# Altium project UltraZOhm_CarrierBoard.PrjPcb (part 7 of 8)

## Sheet GTR_crossover.schdoc
size A4; Author: A. Geiger & E. Liegmann; CompanyName: Technische Hochschule Nürnberg Georg Simon Ohm; Organization: UltraZohm; Address1: Kesslerplatz 12; Address2: 90489 Nürnberg; Address3: GERMANY; SheetNumber: 35; SheetTotal: 36; Website: www.ultrazohm.com
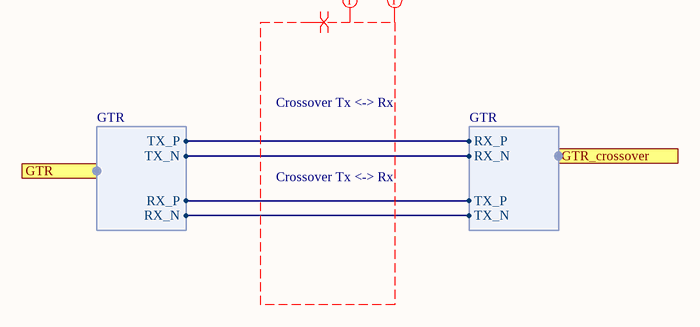
[diagram p21: GTR_crossover.schdoc]

### Ports
GTR (harness GTR), GTR_crossover (harness GTR)

### Harnesses
GTR: RX_N, RX_P, TX_N, TX_P

### Nets
(unnamed): port GTR.RX_N, port GTR_crossover.TX_N
(unnamed): port GTR.RX_P, port GTR_crossover.TX_P
(unnamed): port GTR.TX_N, port GTR_crossover.RX_N
(unnamed): port GTR.TX_P, port GTR_crossover.RX_P

### Layout directives
differential pair: (no net found under the mark)
net class HS: (no net found under the mark)
net class SATA: (no net found under the mark)

### Notes on the sheet
- Crossover Tx <-> Rx
- Title
- Revision:
- Design Engineer:
- Date:
- Project:
- Sheet
- of

## Sheet XMOD.SchDoc
size A4; Author: A. Geiger & E. Liegmann; CompanyName: Technische Hochschule Nürnberg Georg Simon Ohm; Organization: UltraZohm; Address1: Kesslerplatz 12; Address2: 90489 Nürnberg; Address3: GERMANY; SheetNumber: 15; SheetTotal: 36; Website: www.ultrazohm.com
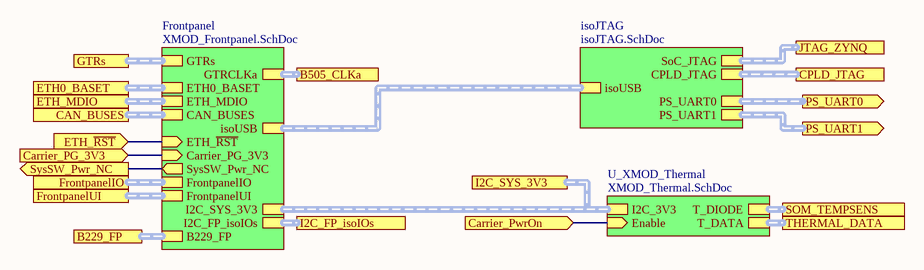
[diagram p22: XMOD.SchDoc]

### Sub-sheets
Frontpanel = XMOD_Frontpanel.SchDoc (file not in this document): GTRs (harness GTRs), ETH0_BASET (harness ETH_BASET), ETH_MDIO (harness ETH_MDIO), isoUSB (harness USB), I2C_SYS_3V3 (harness I2C), FrontpanelUI (harness FrontpanelUI), SysSW_Pwr_NC (out), GTRCLKa (harness MGTCLK), CAN_BUSES (harness CAN_BUSES), FrontpanelIO (harness FrontpanelIO), ETH_~{RST} (in), Carrier_PG_3V3 (in), I2C_FP_isoIOs (harness I2C), B229_FP (harness GTH)
isoJTAG = isoJTAG.SchDoc (file not in this document): SoC_JTAG (harness JTAG), CPLD_JTAG (harness JTAG), PS_UART0 (harness UART), PS_UART1 (harness UART), isoUSB (harness USB)
U_XMOD_Thermal = XMOD_Thermal.SchDoc (file not in this document): I2C_3V3 (harness I2C), T_DIODE (harness T_DIODE), T_DATA (harness T_DATA), Enable (in)

### Ports
B229_FP (harness GTH), B505_CLKa (harness MGTCLK), CAN_BUSES (harness CAN_BUSES), Carrier_PG_3V3 (in), Carrier_PwrOn (in), CPLD_JTAG (harness JTAG), ETH0_BASET (harness ETH_BASET), ETH_MDIO (harness ETH_MDIO), ETH_~{RST} (in), FrontpanelIO (harness FrontpanelIO), FrontpanelUI (harness FrontpanelUI), GTRs (harness GTRs), I2C_FP_isoIOs (harness I2C), I2C_SYS_3V3 (harness I2C), JTAG_ZYNQ (harness JTAG), PS_UART0 (out, harness UART), PS_UART1 (out, harness UART), SOM_TEMPSENS (harness T_DIODE), SysSW_Pwr_NC (out), THERMAL_DATA (harness T_DATA)

### Nets
Carrier_PG_3V3: port Carrier_PG_3V3, sheet Frontpanel/Carrier_PG_3V3
Carrier_PwrOn: port Carrier_PwrOn, sheet U_XMOD_Thermal/Enable
ETH_~{RST}: port ETH_~{RST}, sheet Frontpanel/ETH_~{RST}
SysSW_Pwr_NC: port SysSW_Pwr_NC, sheet Frontpanel/SysSW_Pwr_NC

### Buses and harness runs
harness port B229_FP = sheet Frontpanel/B229_FP
harness port B505_CLKa = sheet Frontpanel/GTRCLKa
harness port CAN_BUSES = sheet Frontpanel/CAN_BUSES
harness port CPLD_JTAG = sheet isoJTAG/CPLD_JTAG
harness port ETH0_BASET = sheet Frontpanel/ETH0_BASET
harness port ETH_MDIO = sheet Frontpanel/ETH_MDIO
harness port FrontpanelIO = sheet Frontpanel/FrontpanelIO
harness port FrontpanelUI = sheet Frontpanel/FrontpanelUI
harness port GTRs = sheet Frontpanel/GTRs
harness port I2C_FP_isoIOs = sheet Frontpanel/I2C_FP_isoIOs
harness port I2C_SYS_3V3 = sheet Frontpanel/I2C_SYS_3V3 = sheet U_XMOD_Thermal/I2C_3V3
harness port JTAG_ZYNQ = sheet isoJTAG/SoC_JTAG
harness port PS_UART0 = sheet isoJTAG/PS_UART0
harness port PS_UART1 = sheet isoJTAG/PS_UART1
harness port SOM_TEMPSENS = sheet U_XMOD_Thermal/T_DIODE
harness port THERMAL_DATA = sheet U_XMOD_Thermal/T_DATA
harness sheet Frontpanel/isoUSB = sheet isoJTAG/isoUSB

### Notes on the sheet
- Title
- Revision:
- Design Engineer:
- Date:
- Project:
- Sheet
- of

## Sheet Collective_FAULT_logic.SchDoc
size A4; Author: A. Geiger & E. Liegmann; CompanyName: Technische Hochschule Nürnberg Georg Simon Ohm; Organization: UltraZohm; Address1: Kesslerplatz 12; Address2: 90489 Nürnberg; Address3: GERMANY; SheetNumber: 10; SheetTotal: 36; Website: www.ultrazohm.com
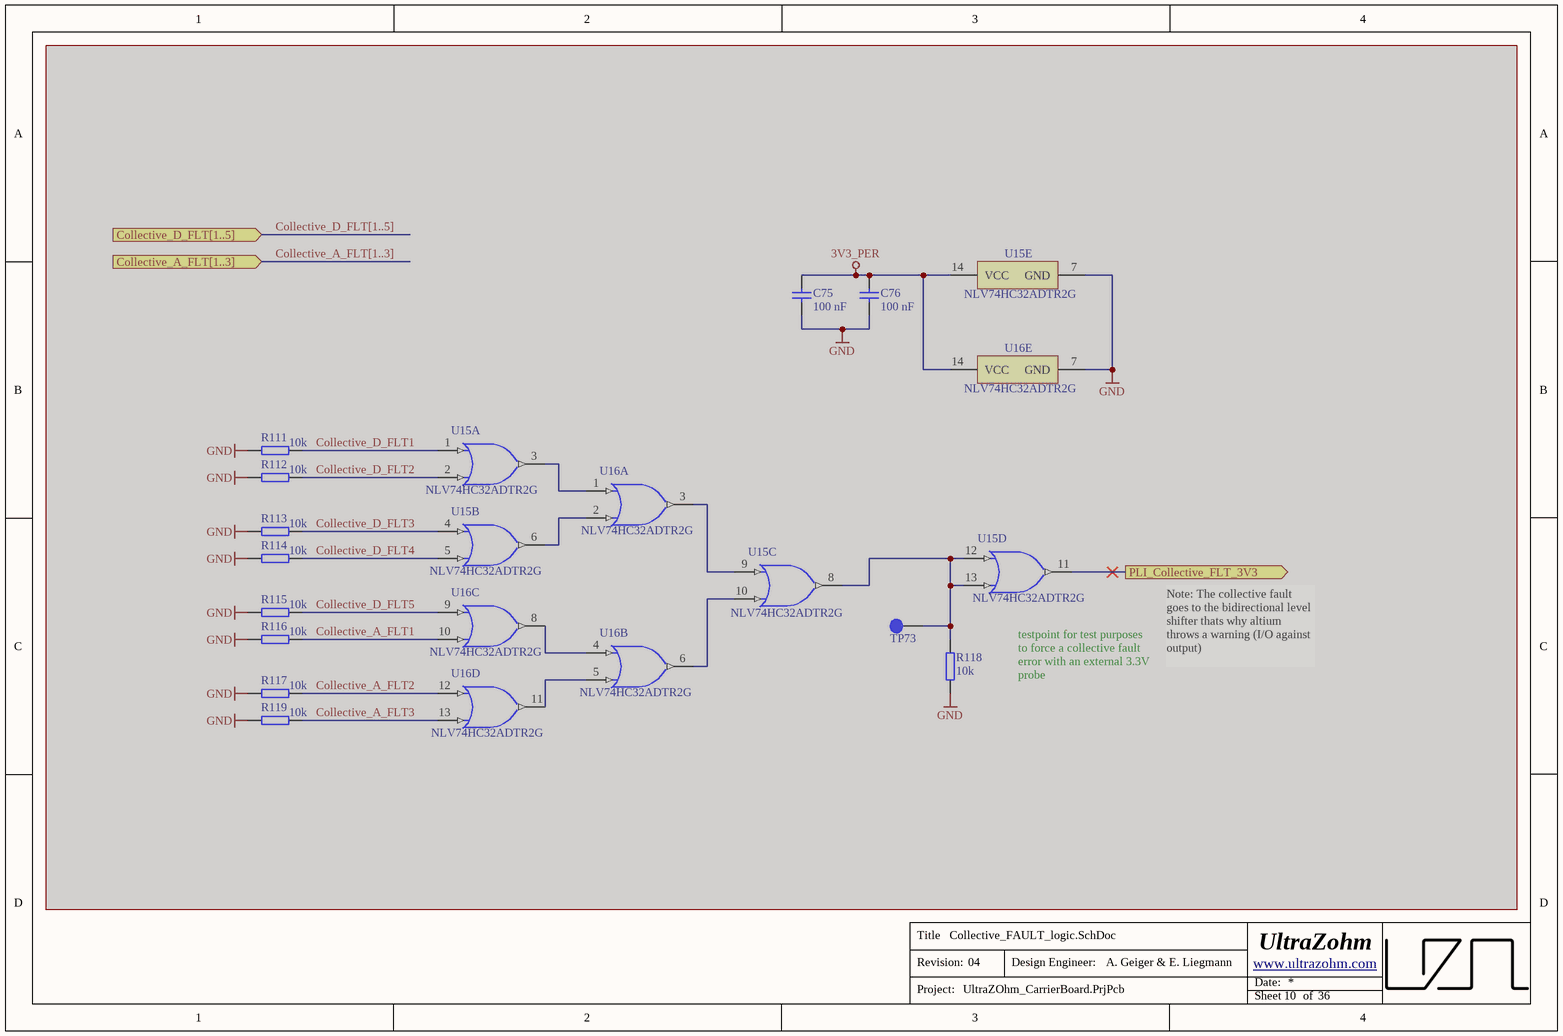
[diagram p23: Collective_FAULT_logic.SchDoc]

### Parts
C75  100 nF  [C_0603_TE]  (masked out: inside a compile mask, not in the netlist)
C76  100 nF  [C_0603_TE]  (masked out: inside a compile mask, not in the netlist)
R111  10k  [R_0603_TE]  (masked out: inside a compile mask, not in the netlist)
R112  10k  [R_0603_TE]  (masked out: inside a compile mask, not in the netlist)
R113  10k  [R_0603_TE]  (masked out: inside a compile mask, not in the netlist)
R114  10k  [R_0603_TE]  (masked out: inside a compile mask, not in the netlist)
R115  10k  [R_0603_TE]  (masked out: inside a compile mask, not in the netlist)
R116  10k  [R_0603_TE]  (masked out: inside a compile mask, not in the netlist)
R117  10k  [R_0603_TE]  (masked out: inside a compile mask, not in the netlist)
R118  10k  [R_0603_TE]  (masked out: inside a compile mask, not in the netlist)
R119  10k  [R_0603_TE]  (masked out: inside a compile mask, not in the netlist)
TP73  Testpoint 1mm  [TP_1mm]  (value not drawn)  (no BOM)  (masked out: inside a compile mask, not in the netlist)
U15  NLV74HC32ADTR2G  [SOP65P640X120-14N]  (parts A,B,C,D,E of 5)  (masked out: inside a compile mask, not in the netlist)
U16  NLV74HC32ADTR2G  [SOP65P640X120-14N]  (parts A,B,C,D,E of 5)  (masked out: inside a compile mask, not in the netlist)

### Ports
Collective_A_FLT[1..3] (in), Collective_D_FLT[1..5] (in), PLI_Collective_FLT_3V3 (out)

### Notes on the sheet
- (near U15) testpoint for test purposes to force a collective fault error with an external 3.3V probe
- Note: The collective fault goes to the bidirectional level shifter thats why altium throws a warning (I/O against output)
- Title
- Revision:
- Design Engineer:
- Date:
- Project:
- Sheet
- of

### Library data of the parts
C75 C76 = UZgen_C_0603_100nF_50V_X7R: Generic capacitor; Manufacturer: UZgen; Tolerance: 10 %; Voltage: 50 V; Created from: AGeiger; Value: 100 nF; Technology: X7R; Manufacturer Part Number: UZgen_C_0603_100nF_50V_X7R; PartID: 1; Created On: 02/07/2024 14:42:23; Device Package: 0603; Mounting Type: SMD; Last Updated: 02/08/2024 14:45:57
R111-R119 = UZgen_R_0603_10k: Generic resistor; Manufacturer: UZgen; Tolerance: 1 %; Created from: AGeiger; Value: 10k; Manufacturer Part Number: UZgen_R_0603_10k; PartID: 1; Created On: 02.07.2024 14:34:53; Device Package: 0603; Mounting Type: SMD; Last Updated: 02.07.2024 14:37:16
TP73 = 25063: AN: 25063; Mixed: SMT
U15 U16 = 30783: AN: 30783; Mixed: SMT; Trenz-Stock: Yes; Temperature-Range: -55/+125; Extra: Quad 2-Input Positive-Or Gate; Case: TSSOP14; HelpURL: b:\AD\adlib\datasheet\ON_Semiconductor\MC74HC32A\; H-ART: NLV74HC32ADTR2G; Storage-Temperature: -65/+150 (Abs)

## Sheet LevelShifting.SchDoc
size A4; Author: A. Geiger & E. Liegmann; CompanyName: Technische Hochschule Nürnberg Georg Simon Ohm; Organization: UltraZohm; Address1: Kesslerplatz 12; Address2: 90489 Nürnberg; Address3: GERMANY; SheetNumber: 11; SheetTotal: 36; Website: www.ultrazohm.com
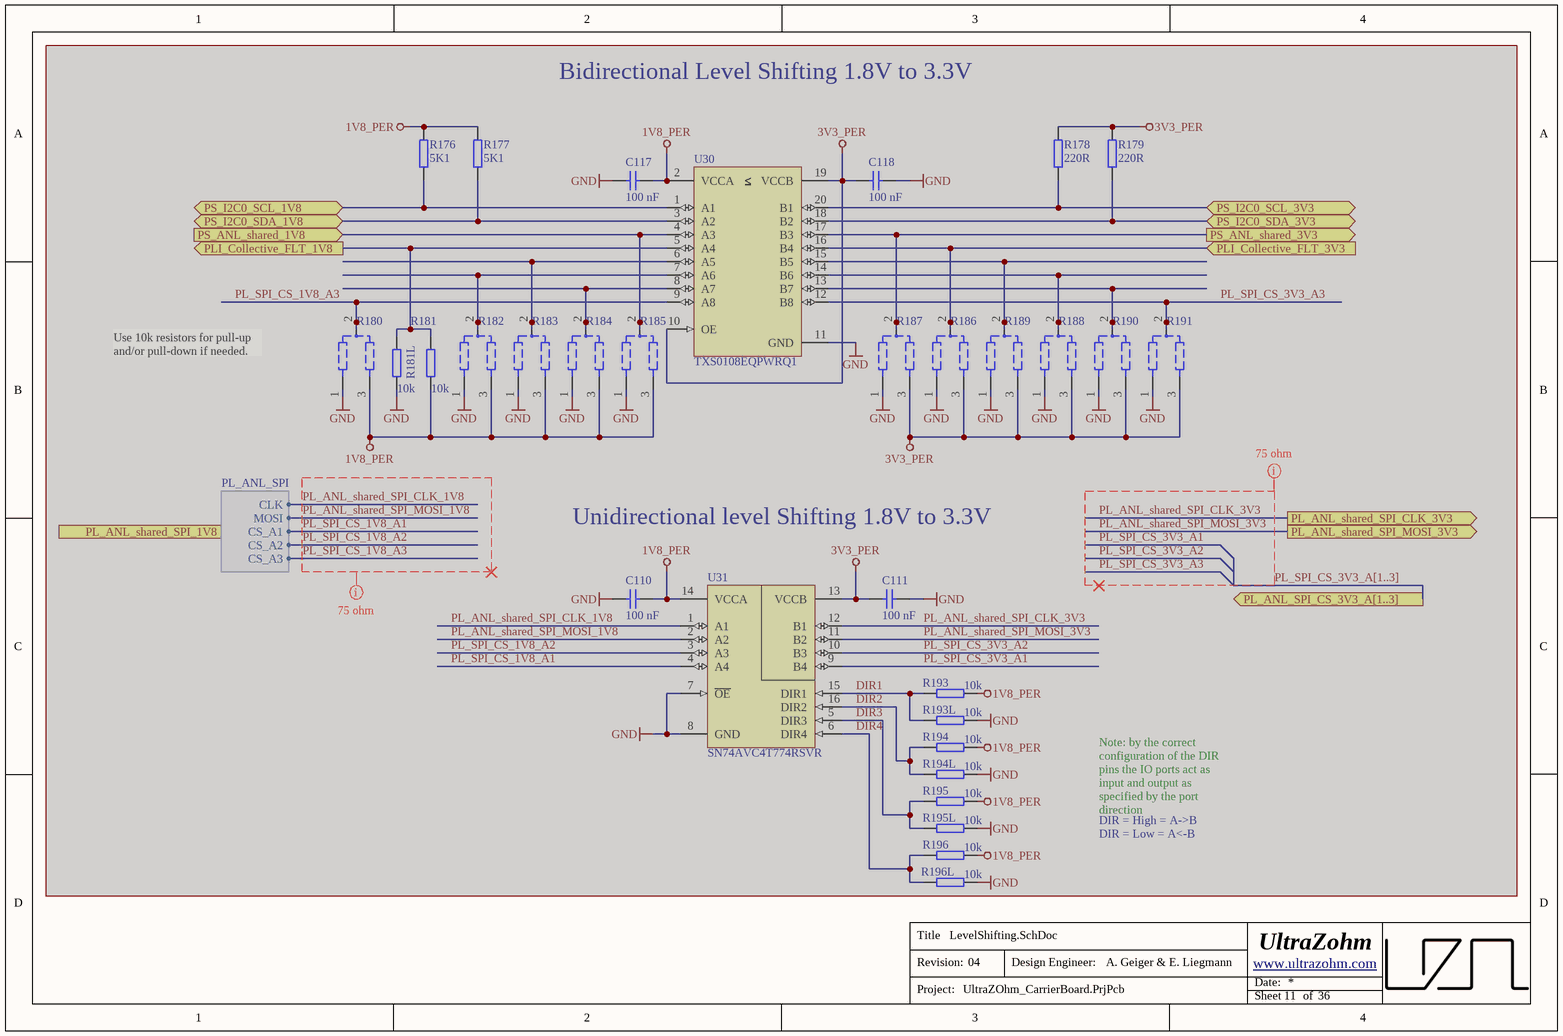
[diagram p24: LevelShifting.SchDoc]

### Parts
C110  100 nF  [C_0603_TE]  (masked out: inside a compile mask, not in the netlist)
C111  100 nF  [C_0603_TE]  (masked out: inside a compile mask, not in the netlist)
C117  100 nF  [C_0603_TE]  (masked out: inside a compile mask, not in the netlist)
C118  100 nF  [C_0603_TE]  (masked out: inside a compile mask, not in the netlist)
R176  5K1  [RESC1608X55N_V]  (masked out: inside a compile mask, not in the netlist)
R177  5K1  [RESC1608X55N_V]  (masked out: inside a compile mask, not in the netlist)
R178  220R  [RESC1608X55N_V]  (masked out: inside a compile mask, not in the netlist)
R179  220R  [RESC1608X55N_V]  (masked out: inside a compile mask, not in the netlist)
R180  Manual Assembly 1608 (0603)  [TP_DUAL_RES_0603]  (value not drawn)  (no BOM)  (masked out: inside a compile mask, not in the netlist)
R181  10k  [R_0603_TE]  (masked out: inside a compile mask, not in the netlist)
R181L  10k  [R_0603_TE]  (masked out: inside a compile mask, not in the netlist)
R182  Manual Assembly 1608 (0603)  [TP_DUAL_RES_0603]  (value not drawn)  (no BOM)  (masked out: inside a compile mask, not in the netlist)
R183  Manual Assembly 1608 (0603)  [TP_DUAL_RES_0603]  (value not drawn)  (no BOM)  (masked out: inside a compile mask, not in the netlist)
R184  Manual Assembly 1608 (0603)  [TP_DUAL_RES_0603]  (value not drawn)  (no BOM)  (masked out: inside a compile mask, not in the netlist)
R185  Manual Assembly 1608 (0603)  [TP_DUAL_RES_0603]  (value not drawn)  (no BOM)  (masked out: inside a compile mask, not in the netlist)
R186  Manual Assembly 1608 (0603)  [TP_DUAL_RES_0603]  (value not drawn)  (no BOM)  (masked out: inside a compile mask, not in the netlist)
R187  Manual Assembly 1608 (0603)  [TP_DUAL_RES_0603]  (value not drawn)  (no BOM)  (masked out: inside a compile mask, not in the netlist)
R188  Manual Assembly 1608 (0603)  [TP_DUAL_RES_0603]  (value not drawn)  (no BOM)  (masked out: inside a compile mask, not in the netlist)
R189  Manual Assembly 1608 (0603)  [TP_DUAL_RES_0603]  (value not drawn)  (no BOM)  (masked out: inside a compile mask, not in the netlist)
R190  Manual Assembly 1608 (0603)  [TP_DUAL_RES_0603]  (value not drawn)  (no BOM)  (masked out: inside a compile mask, not in the netlist)
R191  Manual Assembly 1608 (0603)  [TP_DUAL_RES_0603]  (value not drawn)  (no BOM)  (masked out: inside a compile mask, not in the netlist)
R193  10k  [R_0603_TE]  (masked out: inside a compile mask, not in the netlist)
R193L  10k  [R_0603_TE]  (masked out: inside a compile mask, not in the netlist)
R194  10k  [R_0603_TE]  (masked out: inside a compile mask, not in the netlist)
R194L  10k  [R_0603_TE]  (masked out: inside a compile mask, not in the netlist)
R195  10k  [R_0603_TE]  (masked out: inside a compile mask, not in the netlist)
R195L  10k  [R_0603_TE]  (masked out: inside a compile mask, not in the netlist)
R196  10k  [R_0603_TE]  (masked out: inside a compile mask, not in the netlist)
R196L  10k  [R_0603_TE]  (masked out: inside a compile mask, not in the netlist)
U30  TXS0108EQPWRQ1  [SOP65P640X120-20N]  (masked out: inside a compile mask, not in the netlist)
U31  SN74AVC4T774RSVR  [QFN40P260X180X55-16N]  (masked out: inside a compile mask, not in the netlist)

### Ports
PL_ANL_shared_SPI_1V8 (harness PL_ANL_SPI), PL_ANL_shared_SPI_CLK_3V3 (out), PL_ANL_shared_SPI_MOSI_3V3 (out), PL_ANL_SPI_CS_3V3_A[1..3] (out), PLI_Collective_FLT_1V8 (out), PLI_Collective_FLT_3V3 (in), PS_ANL_shared_1V8 (in), PS_ANL_shared_3V3 (out), PS_I2C0_SCL_1V8 (bidir), PS_I2C0_SCL_3V3 (bidir), PS_I2C0_SDA_1V8 (bidir), PS_I2C0_SDA_3V3 (bidir)

### Harnesses
PL_ANL_SPI: CLK, CS_A1, CS_A2, CS_A3, MOSI

### Layout directives
net class S75: PL_ANL_shared_SPI_CLK_1V8, PL_ANL_shared_SPI_CLK_3V3, PL_ANL_shared_SPI_MOSI_1V8, PL_ANL_shared_SPI_MOSI_3V3, PL_SPI_CS_1V8_A1, PL_SPI_CS_1V8_A2, PL_SPI_CS_1V8_A3, PL_SPI_CS_3V3_A1, PL_SPI_CS_3V3_A2, PL_SPI_CS_3V3_A3, PL_SPI_CS_3V3_A[1..3]

### Notes on the sheet
- Bidirectional Level Shifting 1.8V to 3.3V
- Use 10k resistors for pull-up and/or pull-down if needed.
- Unidirectional level Shifting 1.8V to 3.3V
- DIR = High = A->B
- DIR = Low = A<-B
- Note: by the correct configuration of the DIR pins the IO ports act as input and output as specified by the port direction
- Title
- Revision:
- Design Engineer:
- Date:
- Project:
- Sheet
- of

### Library data of the parts
C110 C111 C117 C118 = UZgen_C_0603_100nF_50V_X7R: as C75 on sheet Collective_FAULT_logic; Value: 100 nF; Technology: X7R; Manufacturer Part Number: UZgen_C_0603_100nF_50V_X7R; PartID: 1; Created On: 02/07/2024 14:42:23; Device Package: 0603; Mounting Type: SMD; Last Updated: 02/08/2024 14:45:57
R176 R177 = 21379: WID SMD 5K1 1% 0,1W; AN: 21379; Mixed: SMT; Value: 5.1K; Preferred: Yes; Extra: BF 1608 (0603); Tolerance: 1%; Case: 1608 (0603); Technology: TK100
R178 R179 = 22324: WID SMD 220R 1% 0,1W; Value: 220; AN: 22324; Mixed: SMT; Extra: BF 1608 (0603); Tolerance: 1%; Case: 1608 (0603); Technology: TK100
R180 R182-R191 = 30792: Manual Assembly Resistors Placeholder 1608 (0603) Dual; AN: 30792; Mixed: MECH
R181 R181L R193 R193L R194 R194L R195 R195L R196 R196L = UZgen_R_0603_10k: as R111-R119 on sheet Collective_FAULT_logic; Value: 10k; Manufacturer Part Number: UZgen_R_0603_10k; PartID: 1; Created On: 02.07.2024 14:34:53; Device Package: 0603; Mounting Type: SMD; Last Updated: 02.07.2024 14:37:16
U30 = 30791: AN: 30791; Mixed: SMT; Temperature-Range: -40/+85; Extra: 8-Bit Bidirectional Voltage Translator for OD/Push-Pull; HelpURL: b:\AD\adlib\datasheet\TI\TXS0108E-Q1\; H-ART: TXS0108EQPWRQ1; Storage-Temperature: -65/+150(Abs); Case: TSSOP20
U31 = 27170: AN: 27170; Mixed: SMT; Trenz-Stock: Yes; Extra: 4-Bit Dual-Supply Bus Transceiver With Configurable Voltage Translationand 3-Sta; HelpURL: B:\ad\adlib\datasheet\sn74avc4t774; Case: UQFN-16; H-ART: SN74AVC4T774RSVR

## Sheet LevelShiftingXMOD.SchDoc
size A4; Author: A. Geiger & E. Liegmann; CompanyName: Technische Hochschule Nürnberg Georg Simon Ohm; Organization: UltraZohm; Address1: Kesslerplatz 12; Address2: 90489 Nürnberg; Address3: GERMANY; SheetNumber: 23; SheetTotal: 36; Website: www.ultrazohm.com
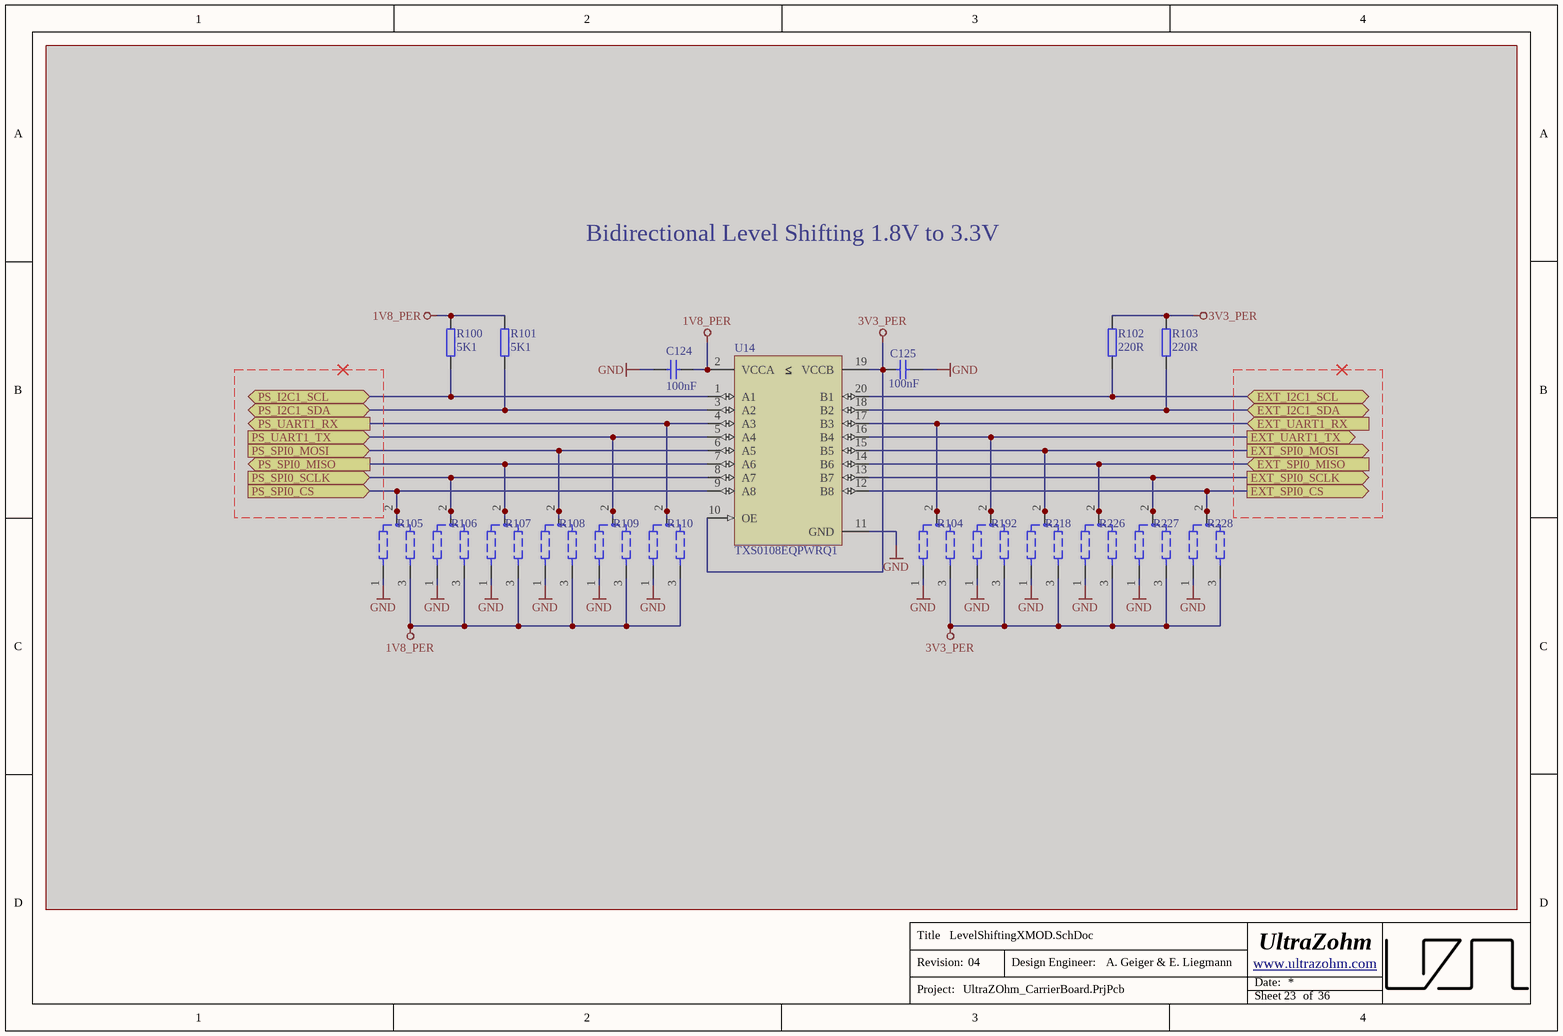
[diagram p25: LevelShiftingXMOD.SchDoc]

### Parts
(Parts that share a designator on the sheet are numbered #1, #2 ... from top to bottom, then left to right.)
C124  100nF  [CAPC1608X90N_V]  (masked out: inside a compile mask, not in the netlist)
C125  100nF  [CAPC1608X90N_V]  (masked out: inside a compile mask, not in the netlist)
R100  5K1  [RESC1608X55N_V]  (masked out: inside a compile mask, not in the netlist)
R101  5K1  [RESC1608X55N_V]  (masked out: inside a compile mask, not in the netlist)
R102  220R  [RESC1608X55N_V]  (masked out: inside a compile mask, not in the netlist)
R103  220R  [RESC1608X55N_V]  (masked out: inside a compile mask, not in the netlist)
R104  Manual Assembly 1608 (0603)  [TP_DUAL_RES_0603]  (value not drawn)  (no BOM)  (masked out: inside a compile mask, not in the netlist)
R105  Manual Assembly 1608 (0603)  [TP_DUAL_RES_0603]  (value not drawn)  (no BOM)  (masked out: inside a compile mask, not in the netlist)
R106  Manual Assembly 1608 (0603)  [TP_DUAL_RES_0603]  (value not drawn)  (no BOM)  (masked out: inside a compile mask, not in the netlist)
R107  Manual Assembly 1608 (0603)  [TP_DUAL_RES_0603]  (value not drawn)  (no BOM)  (masked out: inside a compile mask, not in the netlist)
R108#2  Manual Assembly 1608 (0603)  [TP_DUAL_RES_0603]  (value not drawn)  (no BOM)  (masked out: inside a compile mask, not in the netlist)
R109#2  Manual Assembly 1608 (0603)  [TP_DUAL_RES_0603]  (value not drawn)  (no BOM)  (masked out: inside a compile mask, not in the netlist)
R110#2  Manual Assembly 1608 (0603)  [TP_DUAL_RES_0603]  (value not drawn)  (no BOM)  (masked out: inside a compile mask, not in the netlist)
R192  Manual Assembly 1608 (0603)  [TP_DUAL_RES_0603]  (value not drawn)  (no BOM)  (masked out: inside a compile mask, not in the netlist)
R218  Manual Assembly 1608 (0603)  [TP_DUAL_RES_0603]  (value not drawn)  (no BOM)  (masked out: inside a compile mask, not in the netlist)
R226  Manual Assembly 1608 (0603)  [TP_DUAL_RES_0603]  (value not drawn)  (no BOM)  (masked out: inside a compile mask, not in the netlist)
R227  Manual Assembly 1608 (0603)  [TP_DUAL_RES_0603]  (value not drawn)  (no BOM)  (masked out: inside a compile mask, not in the netlist)
R228  Manual Assembly 1608 (0603)  [TP_DUAL_RES_0603]  (value not drawn)  (no BOM)  (masked out: inside a compile mask, not in the netlist)
U14  TXS0108EQPWRQ1  [SOP65P640X120-20N]  (masked out: inside a compile mask, not in the netlist)

### Ports
EXT_I2C1_SCL (bidir), EXT_I2C1_SDA (bidir), EXT_SPI0_CS (out), EXT_SPI0_MISO (in), EXT_SPI0_MOSI (out), EXT_SPI0_SCLK (out), EXT_UART1_RX (in), EXT_UART1_TX (out), PS_I2C1_SCL (bidir), PS_I2C1_SDA (bidir), PS_SPI0_CS (in), PS_SPI0_MISO (out), PS_SPI0_MOSI (in), PS_SPI0_SCLK (in), PS_UART1_RX (out), PS_UART1_TX (in)

### Notes on the sheet
- Bidirectional Level Shifting 1.8V to 3.3V
- Title
- Revision:
- Design Engineer:
- Date:
- Project:
- Sheet
- of

### Library data of the parts
C124 C125 = 21382: KON 100nF 50V X7R ±10% SMD BF 1608 (0603); Value: 100n; AN: 21382; Mixed: SMT; Preferred: Yes; Temperature-Range: -55/+125; Tolerance: ±10%; Voltage: 50V; Technology: X7R; Case: 1608 (0603)
R100 R101 = 21379: WID SMD 5K1 1% 0,1W; Value: 5.1K; AN: 21379; Mixed: SMT; Preferred: Yes; Extra: BF 1608 (0603); Tolerance: 1%; Case: 1608 (0603); Technology: TK100
R102 R103 = 22324: as R178 on sheet LevelShifting; Tolerance: 1%; Case: 1608 (0603); Technology: TK100
R104-R107 R108#2 R109#2 R110#2 R192 R218 R226-R228 = 30792: as R180 on sheet LevelShifting
U14 = 30791: as U30 on sheet LevelShifting; HelpURL: b:\AD\adlib\datasheet\TI\TXS0108E-Q1\; H-ART: TXS0108EQPWRQ1; Storage-Temperature: -65/+150(Abs); Case: TSSOP20

## Sheet isoGPIO.SchDoc
size A4; Author: A. Geiger & E. Liegmann; CompanyName: Technische Hochschule Nürnberg Georg Simon Ohm; Organization: UltraZohm; Address1: Kesslerplatz 12; Address2: 90489 Nürnberg; Address3: GERMANY; SheetNumber: 18; SheetTotal: 36; Website: www.ultrazohm.com
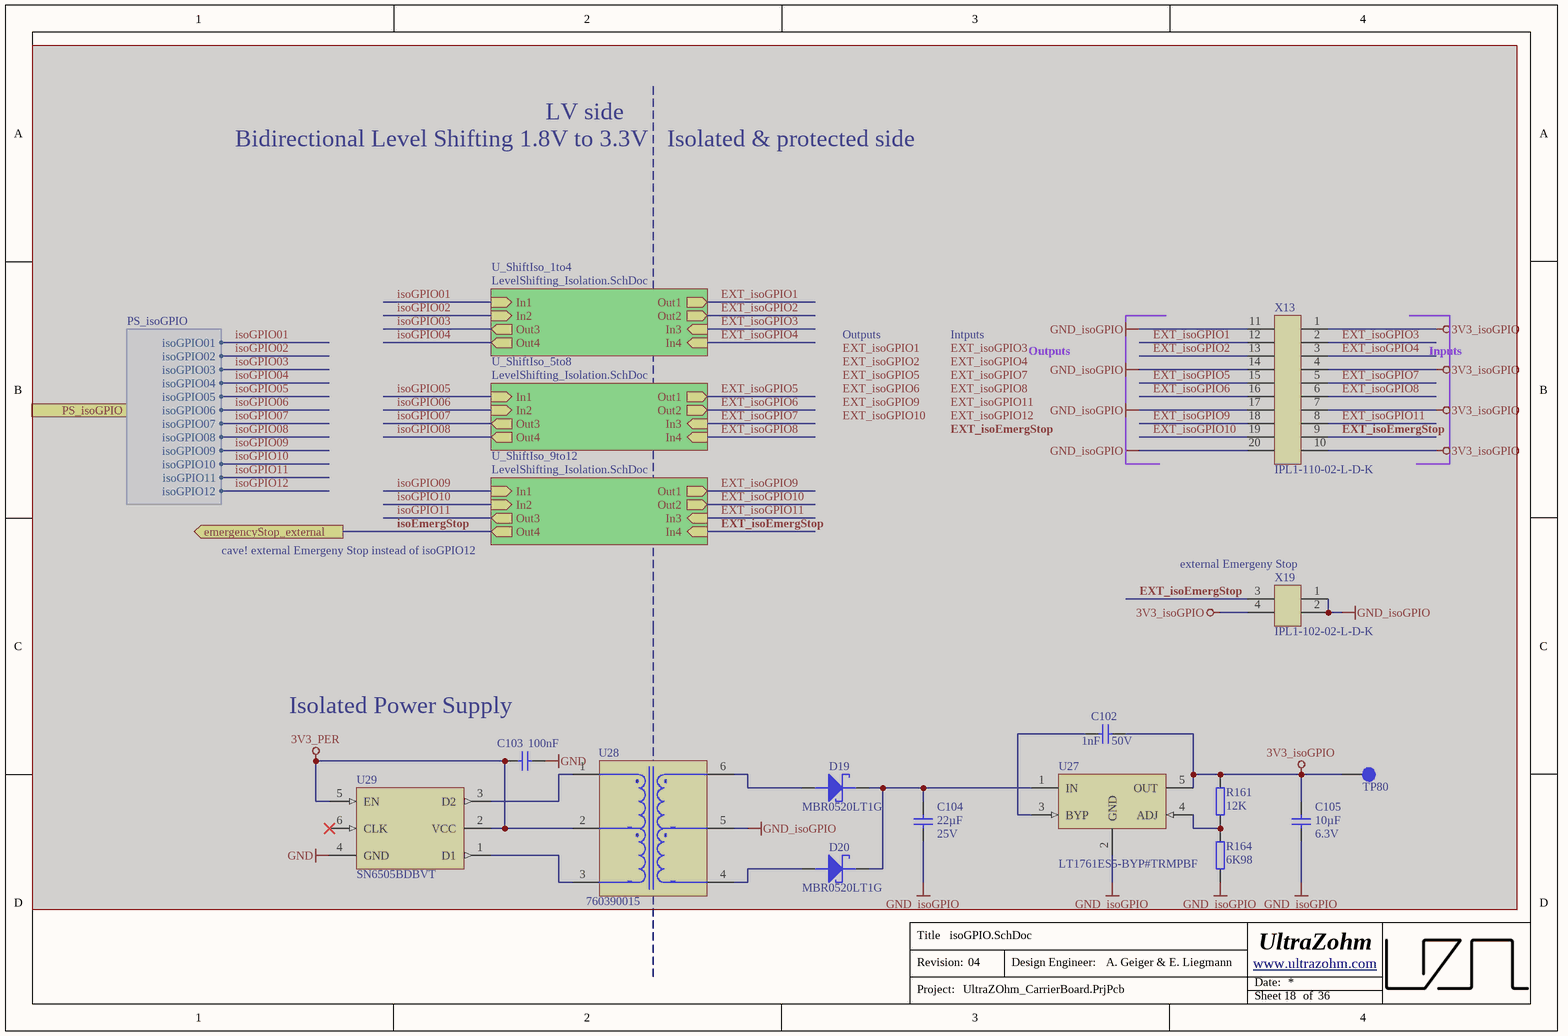
[diagram p26: isoGPIO.SchDoc]

### Parts
(Parts that share a designator on the sheet are numbered #1, #2 ... from top to bottom, then left to right.)
C102  1nF  Voltage: 50V  [CAPC1608X90N_V]  (masked out: inside a compile mask, not in the netlist)
C103  100nF  [CAPC1608X90N_V]  (masked out: inside a compile mask, not in the netlist)
C104  22µF  Voltage: 25V  [CAPC2012X135N_V]  (masked out: inside a compile mask, not in the netlist)
C105  10µF  Voltage: 6.3V  [CAPC1608X90N_V]  (masked out: inside a compile mask, not in the netlist)
D19#2  MBR0520LT1G  [SOD3816X120N]  (masked out: inside a compile mask, not in the netlist)
D20#2  MBR0520LT1G  [SOD3816X120N]  (masked out: inside a compile mask, not in the netlist)
R161  12K  [RESC1608X55N_V]  (masked out: inside a compile mask, not in the netlist)
R164  6K98  [RESC1608X55N_V]  (masked out: inside a compile mask, not in the netlist)
TP80  Testpoint 1mm  [TP_1mm]  (value not drawn)  (masked out: inside a compile mask, not in the netlist)
U27  LT1761ES5-BYP#TRMPBF  [SOT23-5_N]  (masked out: inside a compile mask, not in the netlist)
U28  760390015  [760390015]  (masked out: inside a compile mask, not in the netlist)
U29  SN6505BDBVT  [SOT95P280X145-6N]  (masked out: inside a compile mask, not in the netlist)
X13  IPL1-110-02-L-D-K  [IPL1-110-02-L-D-K]  (masked out: inside a compile mask, not in the netlist)
X19  IPL1-102-02-L-D-K  [IPL1-102-02-L-D-K]  (masked out: inside a compile mask, not in the netlist)

### Sub-sheets
U_ShiftIso_1to4 = LevelShifting_Isolation.SchDoc (masked out): In1 (in), In2 (in), In3 (in), In4 (in), Out1 (out), Out2 (out), Out4 (out), Out3 (out)
U_ShiftIso_5to8 = LevelShifting_Isolation.SchDoc (masked out): In1 (in), In2 (in), In3 (in), In4 (in), Out1 (out), Out2 (out), Out4 (out), Out3 (out)
U_ShiftIso_9to12 = LevelShifting_Isolation.SchDoc (masked out): In1 (in), In2 (in), In3 (in), In4 (in), Out1 (out), Out2 (out), Out4 (out), Out3 (out)

### Ports
emergencyStop_external (out), PS_isoGPIO (harness PS_isoGPIO)

### Harnesses
PS_isoGPIO: isoGPIO01, isoGPIO02, isoGPIO03, isoGPIO05, isoGPIO04, isoGPIO07, isoGPIO08, isoGPIO09, isoGPIO06, isoGPIO10, isoGPIO11, isoGPIO12

### Notes on the sheet
- Bidirectional Level Shifting 1.8V to 3.3V
- LV side
- Isolated & protected side
- Outputs
- Intputs
- Inputs
- cave! external Emergeny Stop instead of isoGPIO12
- (near X19) external Emergeny Stop
- (near C103) Isolated Power Supply
- Title
- Revision:
- Design Engineer:
- Date:
- Project:
- Sheet
- of

### Library data of the parts
C102 = 22523: KON 1nF 50V NP0 5% SMD BF 1608 (0603); Value: 1n; AN: 22523; Mixed: SMT; Technology: NP0; Case: 1608 (0603)
C103 = 21382: as C124 on sheet LevelShiftingXMOD; Tolerance: ±10%; Voltage: 50V; Technology: X7R; Case: 1608 (0603)
C104 = 29556: KON 22µF 25V  X5R 20% SMD BF 2012 (0805); Value: 22u; AN: 29556; Mixed: SMT; Temperature-Range: -55/+85; Technology: X5R; Case: 2012 (0805); Tolerance: 20%
C105 = 22918: KON 10µF 6,3V X5R SMD BF 1608 (0603); Value: 10u; AN: 22918; Mixed: SMT; Temperature-Range: -55/+85; Technology: X5R; Case: 1608 (0603)
D19#2 D20#2 = 26768: Schottky Diode 0.5A 20V SOD-123; AN: 26768; Mixed: SMT; Extra: AEC−Q101; Value: 20V; Case: SOD123-FC; Voltage: 0.5A; HelpURL: B:\AD\adlib\datasheet\MBR0520; H-ART: MBR0520LT1G
R161 = 22655: WID SMD 12K 1% 0,1W; AN: 22655; Mixed: SMT; Extra: BF 1608 (0603); Tolerance: 1%; Case: 1608 (0603); Technology: TK100; Value: 12K
R164 = 26473: WID SMD 6K98 1% 0,1W  BF 1608 (0603); AN: 26473; Mixed: SMT; Value: 6.98k; Preferred: Yes; Tolerance: 1%; Case: 1608 (0603); Technology: TK100
TP80 = 25063: AN: 25063; Mixed: SMT
U27 = LT1761ES5-BYP#TRMPBF: 100mA, Low Noise, LDO Micropower Regulators; belongs to SN74AVC4T774RSVR; Manufacturer: Linear Technology; Created from: MGremer; Manufacturer Part Number: LT1761ES5-BYP#TRMPBF; PartID: 5; Created On: 30.11.2020 13:55:34; ComponentLink1Description: Datasheet; ComponentLink1URL: https://www.analog.com/media/en/technical-documentation/data-sheets/1761sff.pdf; Component Type: LDO Micropower; Device Package: TSOT-23; Last Updated: 15.02.2021 10:27:30; Mounting Type: SMD; Supplier 1: Farnell; Supplier Part Number 1: 1663782; Type: LDO Micropower Regulator; Live Cycle Status: 1; Stock number: not stored
U28 = 30767: AN: 30767; Mixed: SMT; Temperature-Range: -40/+125; Extra: Push-Pull Transformer 1:2 0.35A; Case: MID-PPTI; HelpURL: b:\AD\adlib\datasheet\Wuerth\MID-PPTI\760390015\; H-ART: 760390015
U29 = 30768: AN: 30768; Mixed: SMT; Temperature-Range: -55/+125; Extra: 1-A Transformer Driver for Isolated Power Supplies SOT23-6; Case: SOT23-6; HelpURL: b:\AD\adlib\datasheet\TI\SN6505x\; H-ART: SN6505BDBVT; Storage-Temperature: -65/+150 (Abs)
X13 = 30765: AN: 30765; Mixed: SMT; H-ART: IPL1-110-02-L-D-K-TR; Temperature-Range: -55/+125; Extra: Connector Header IPL1, 2-row 20pos, key polarization, SMT 0°; Case: IPL1; HelpURL: b:\AD\adlib\datasheet\Samtec\IPL1-SMT\
X19 = 30759: AN: 30759; Mixed: SMT; H-ART: IPL1-102-02-L-D-K-TR; Temperature-Range: -55/+125; Extra: Connector Header IPL1, 2-row 4pos, key polarization, SMT 0°; Case: IPL1; HelpURL: b:\AD\adlib\datasheet\Samtec\IPL1-SMT\

## Sheet Pilot_Line.SchDoc
size A4; Author: A. Geiger & E. Liegmann; CompanyName: Technische Hochschule Nürnberg Georg Simon Ohm; Organization: UltraZohm; Address1: Kesslerplatz 12; Address2: 90489 Nürnberg; Address3: GERMANY; SheetNumber: 12; SheetTotal: 36; Website: www.ultrazohm.com
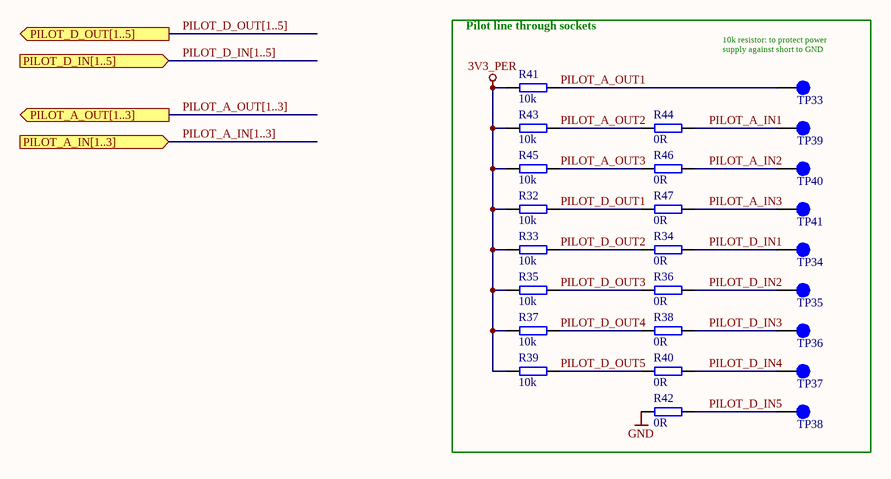
[diagram p27: Pilot_Line.SchDoc]

### Parts
R32  10k  [R_0603_TE]
R33  10k  [R_0603_TE]
R34  0R  [R_0603_TE]
R35  10k  [R_0603_TE]
R36  0R  [R_0603_TE]
R37  10k  [R_0603_TE]
R38  0R  [R_0603_TE]
R39  10k  [R_0603_TE]
R40  0R  [R_0603_TE]
R41  10k  [R_0603_TE]
R42  0R  [R_0603_TE]
R43  10k  [R_0603_TE]
R44  0R  [R_0603_TE]
R45  10k  [R_0603_TE]
R46  0R  [R_0603_TE]
R47  0R  [R_0603_TE]
TP33  Testpoint 1mm  [TP_1mm]  (value not drawn)
TP34  Testpoint 1mm  [TP_1mm]  (value not drawn)
TP35  Testpoint 1mm  [TP_1mm]  (value not drawn)
TP36  Testpoint 1mm  [TP_1mm]  (value not drawn)
TP37  Testpoint 1mm  [TP_1mm]  (value not drawn)
TP38  Testpoint 1mm  [TP_1mm]  (value not drawn)
TP39  Testpoint 1mm  [TP_1mm]  (value not drawn)
TP40  Testpoint 1mm  [TP_1mm]  (value not drawn)
TP41  Testpoint 1mm  [TP_1mm]  (value not drawn)

### Blocks framed on the sheet
Pilot line through sockets: R32-R47 TP33-TP41

### Ports
PILOT_A_IN[1..3] (in), PILOT_A_OUT[1..3] (out), PILOT_D_IN[1..5] (in), PILOT_D_OUT[1..5] (out)

### Nets
3V3_PER: R32.1 R33.1 R35.1 R37.1 R39.1 R41.1 R43.1 R45.1
GND: R42.1
PILOT_A_IN1: R44.2 TP39.1
PILOT_A_IN2: R46.2 TP40.1
PILOT_A_IN3: R47.2 TP41.1
PILOT_A_OUT1: R41.2 TP33.1
PILOT_A_OUT2: R43.2 R44.1
PILOT_A_OUT3: R45.2 R46.1
PILOT_D_IN1: R34.2 TP34.1
PILOT_D_IN2: R36.2 TP35.1
PILOT_D_IN3: R38.2 TP36.1
PILOT_D_IN4: R40.2 TP37.1
PILOT_D_IN5: R42.2 TP38.1
PILOT_D_OUT1: R32.2 R47.1
PILOT_D_OUT2: R33.2 R34.1
PILOT_D_OUT3: R35.2 R36.1
PILOT_D_OUT4: R37.2 R38.1
PILOT_D_OUT5: R39.2 R40.1

### Buses and harness runs
bus PILOT_A_IN[1..3] = port PILOT_A_IN[1..3]
bus PILOT_A_OUT[1..3] = port PILOT_A_OUT[1..3]
bus PILOT_D_IN[1..5] = port PILOT_D_IN[1..5]
bus PILOT_D_OUT[1..5] = port PILOT_D_OUT[1..5]

### Notes on the sheet
- (near TP33) 10k resistor: to protect power supply against short to GND
- Title
- Revision:
- Design Engineer:
- Date:
- Project:
- Sheet
- of

### Library data of the parts
R32 R33 R35 R37 R39 R41 R43 R45 = UZgen_R_0603_10k: as R111-R119 on sheet Collective_FAULT_logic; Value: 10k; Manufacturer Part Number: UZgen_R_0603_10k; PartID: 1; Created On: 02.07.2024 14:34:53; Device Package: 0603; Mounting Type: SMD; Last Updated: 02.07.2024 14:37:16
R34 R36 R38 R40 R42 R44 R46 R47 = UZgen_R_0603_0R: Generic resistor; Manufacturer: UZgen; Tolerance: 1 %; Created from: UZgenTool; Value: 0R; Manufacturer Part Number: UZgen_R_0603_0R; PartID: 581; Created On: 08.07.2024 14:34:30; Device Package: 0603; Mounting Type: SMD; Last Updated: 08.07.2024 14:34:30
TP33-TP41 = 25063: AN: 25063; Mixed: SMT

## Sheet CPLD_Programming.SchDoc
size A4; Author: A. Geiger & E. Liegmann; CompanyName: Technische Hochschule Nürnberg Georg Simon Ohm; Organization: UltraZohm; Address1: Kesslerplatz 12; Address2: 90489 Nürnberg; Address3: GERMANY; SheetNumber: 13; SheetTotal: 36; Website: www.ultrazohm.com
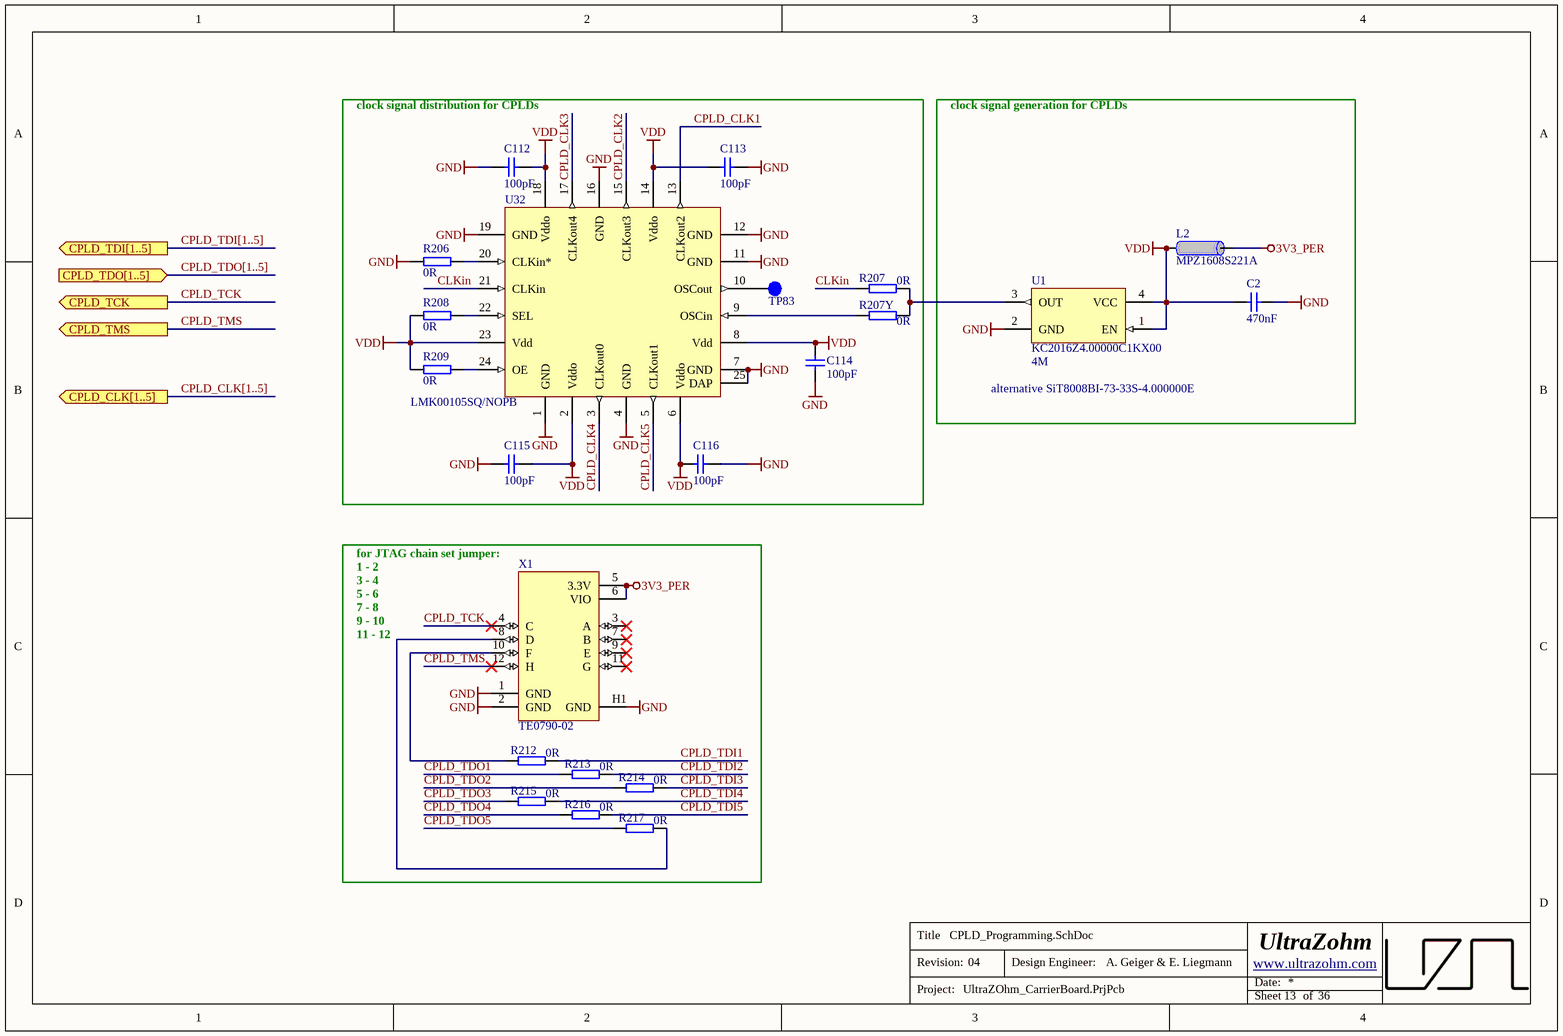
[diagram p28: CPLD_Programming.SchDoc]

### Parts
C2  470nF  [CAPC1608X90N_V]
C112  100pF  [CAPC1608X90N_V]
C113  100pF  [CAPC1608X90N_V]
C114  100pF  [CAPC1608X90N_V]
C115  100pF  [CAPC1608X90N_V]
C116  100pF  [CAPC1608X90N_V]
L2  MPZ1608S221A  [INDC1608X95N_V]
R206  0R  [R_0603_TE]
R207  0R  [R_0603_TE]
R207Y  0R  [R_0603_TE]
R208  0R  [R_0603_TE]
R209  0R  [R_0603_TE]
R212  0R  [R_0603_TE]
R213  0R  [R_0603_TE]
R214  0R  [R_0603_TE]
R215  0R  [R_0603_TE]
R216  0R  [R_0603_TE]
R217  0R  [R_0603_TE]
TP83  Testpoint 1mm  [TP_1mm]  (value not drawn)
U1  KC2016Z4.00000C1KX00  value 4M  [2016]
U32  LMK00105SQ/NOPB  [QFN50P400X400X80-25N]
X1  TE0790-02  [TE0790-Base]

### Blocks framed on the sheet
clock signal distribution for CPLDs: C112-C116 R206 R207 R207Y R208 R209 TP83 U32

### Ports
CPLD_CLK[1..5] (out), CPLD_TCK (out), CPLD_TDI[1..5] (out), CPLD_TDO[1..5] (in), CPLD_TMS (out)

### Nets
3V3_PER: L2.2 X1.5(3.3V) X1.6(VIO)
GND: C2.1 C112.2 C113.1 C114.2 C115.2 C116.1 R206.2 U1.2(GND) U32.1(GND) U32.4(GND) U32.7(GND) U32.11(GND) U32.12(GND) U32.16(GND) U32.19(GND) U32.25(DAP) X1.1(GND) X1.2(GND) X1.H1(GND)
VDD: C2.2 C112.1 C113.2 C114.1 C115.1 C116.2 L2.1 R208.1 R209.2 U1.1(EN) U1.4(VCC) U32.2(Vddo) U32.6(Vddo) U32.8(Vdd) U32.14(Vddo) U32.18(Vddo) U32.23(Vdd)
CLKin: R207.1 U32.21(CLKin)
CPLD_CLK1: U32.13(CLKout2)
CPLD_CLK2: U32.15(CLKout3)
CPLD_CLK3: U32.17(CLKout4)
CPLD_CLK4: U32.3(CLKout0)
CPLD_CLK5: U32.5(CLKout1)
CPLD_TCK: X1.4(C) ; port CPLD_TCK
CPLD_TDI1: R212.2
CPLD_TDI2: R213.2
CPLD_TDI3: R214.2
CPLD_TDI4: R215.2
CPLD_TDI5: R216.2
CPLD_TDO1: R213.1
CPLD_TDO2: R214.1
CPLD_TDO3: R215.1
CPLD_TDO4: R216.1
CPLD_TDO5: R217.1
CPLD_TMS: X1.12(H) ; port CPLD_TMS
NetR206_1: R206.1 U32.20(CLKin*)
NetR207_2: R207.2 R207Y.2 U1.3(OUT)
NetR207Y_1: R207Y.1 U32.9(OSCin)
NetR208_2: R208.2 U32.22(SEL)
NetR209_1: R209.1 U32.24(OE)
NetR212_1: R212.1 X1.10(F)
NetR217_2: R217.2 X1.8(D)
NetTP83_1: TP83.1 U32.10(OSCout)

Not connected (* = marked no-connect by the designer): X1 3(A)* 7(B)* 9(E)* 11(G)*

### Buses and harness runs
bus CPLD_CLK[1..5] = port CPLD_CLK[1..5]
bus CPLD_TDI[1..5] = port CPLD_TDI[1..5]
bus CPLD_TDO[1..5] = port CPLD_TDO[1..5]

### Notes on the sheet
- clock signal generation for CPLDs
- alternative SiT8008BI-73-33S-4.000000E
- (near X1) for JTAG chain set jumper:
  1 - 2
  3 - 4
  5 - 6
  7 - 8
  9 - 10
  11 - 12
- Title
- Revision:
- Design Engineer:
- Date:
- Project:
- Sheet
- of

### Library data of the parts
C2 = 25476: KON 470nF 50V X7R SMD  BF 1608 (0603); Value: 470n; AN: 25476; Mixed: SMT; Preferred: Yes; Temperature-Range: -55/+125; Voltage: 50V; Technology: X7R; Case: 1608 (0603)
C112-C116 = 21381: KON 100pF 50V NP0 ±5% SMD BF 1608 (0603); Value: 100p; AN: 21381; Mixed: SMT; Preferred: Yes; Tolerance: ±5%; Voltage: 50V; Technology: C0G NP0; Case: 1608 (0603)
L2 = 22718: Ferritdurchführung MPZ1608S221A; Value: 220 OHm @ 100MHz; AN: 22718; Mixed: SMT; Trenz-Stock: Yes; Temperature-Range: -55/+125; Extra: 0,05 Ohm DC, 220 Ohm bei 100MHz. 2A; Case: 1608 (0603); HelpURL: B:\AD\adlib\datasheet\MPZ1608; Preferred: Yes; H-ART: MPZ1608S221A; Storage-Temperature: -55/+125
R206 R207 R207Y R208 R209 R212-R217 = UZgen_R_0603_0R: as R34 on sheet Pilot_Line; Value: 0R; Manufacturer Part Number: UZgen_R_0603_0R; PartID: 581; Created On: 08.07.2024 14:34:30; Device Package: 0603; Mounting Type: SMD; Last Updated: 08.07.2024 14:34:30
TP83 = 25063: AN: 25063; Mixed: SMT
U1 = 30896: KC2016Z4.00000C1KX00 Oszillator 4.000000MHz; AN: 30896; Voltage: 1.8-3.3V; Tolerance: 20ppm; Mixed: SMT; Temperature-Range: -40/+85; Extra: 1.71 - 3.63V, -40° C - 85° C , ±20 ppm , 2x1,6 mm; Case: 2.0  x 1.6mm; HelpURL: b:\AD\adlib\datasheet\Kyocera\KCxxxxZ\; H-ART: KC2016Z4.00000C1KX00; Storage-Temperature: -55/+150(Abs)
U32 = 30774: AN: 30774; Mixed: SMT; Temperature-Range: -40/+85; Extra: Clock Fanout Buffer (Distribution), Multiplexer, Translator 2:5 200MHz 24-WFQN; Case: WQFN24; HelpURL: b:\AD\adlib\datasheet\TI\LMK00105\; H-ART: LMK00105SQ/NOPB; Storage-Temperature: -65/+150 (Tj Abs)
X1 = TE0790-02: Adapter USG, JTAG, XMOD, FTDI 2CH; Manufacturer: Trenz Electronic GmbH; Value: USB, JTAG, XMOD; Created from: MGremer; Manufacturer Part Number: TE0790-02; PartID: 1; Created On: 20.01.2021 11:19:04; ComponentLink1Description: Datasheet; ComponentLink1URL: https://www.ftdichip.com/Support/Documents/DataSheets/ICs/DS_FT2232H.pdf; Component Type: Adapter USB, JTAG, XMOD; Device Package: PCB; Last Updated: 20.01.2021 11:19:04; Mounting Type: THT; Supplier 1: Digikey; Supplier Part Number 1: 1686-1023-ND; Type: Adapter; Live Cycle Status: 1; Stock number: not stored

## Sheet Power_Supply_1V8.SchDoc
size A4; Author: A. Geiger & E. Liegmann; CompanyName: Technische Hochschule Nürnberg Georg Simon Ohm; Organization: UltraZohm; Address1: Kesslerplatz 12; Address2: 90489 Nürnberg; Address3: GERMANY; SheetNumber: 30; SheetTotal: 36; Website: www.ultrazohm.com
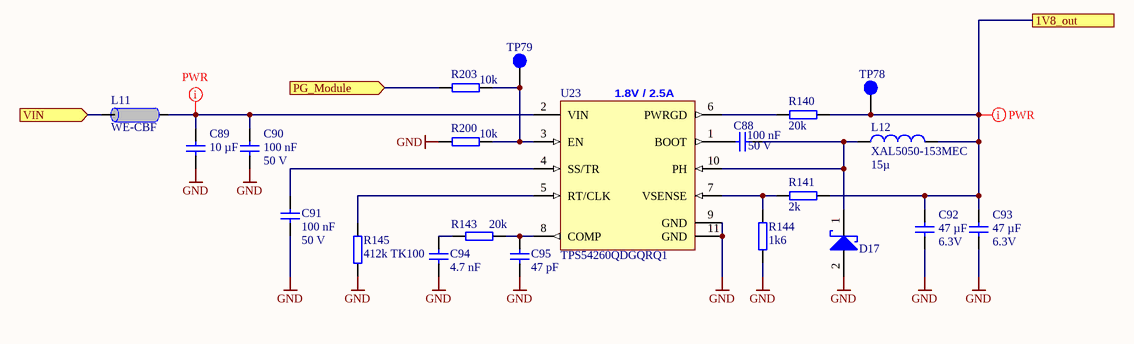
[diagram p29: Power_Supply_1V8.SchDoc]

### Parts
C88  100 nF  Voltage: 50 V  [C_0603_TE]
C89  10 µF  [C_1206_TE]
C90  100 nF  Voltage: 50 V  [C_0603_TE]
C91  100 nF  Voltage: 50 V  [C_0603_TE]
C92  47 µF  Voltage: 6.3V  [C_0805_TE]
C93  47 µF  Voltage: 6.3V  [C_0805_TE]
C94  4.7 nF  [C_0603_TE]
C95  47 pF  [C_0603_TE]
D17  STPS340UY  [SMB]  (value not drawn)
L11  WE-CBF  [INDC2012X92N_V]
L12  XAL5050-153MEC  value 15µ  [IND_XAL5050]
R140  20k  [R_0603_TE]
R141  2k  [R_0603_TE]
R143  20k  [R_0603_TE]
R144  1k6  [R_0603_TE]
R145  412k TK100  [R_0603_TE]
R200  10k  [R_0603_TE]
R203  10k  [R_0603_TE]
TP78  Testpoint 1mm  [TP_1mm]  (value not drawn)
TP79  Testpoint 1mm  [TP_1mm]  (value not drawn)
U23  TPS54260QDGQRQ1  [TSSOP50P490X110-11N-TI-DGQ]

### Ports
1V8_out, PG_Module (in), VIN (in)

### Nets
GND: C89.2 C90.1 C91.1 C92.1 C93.1 C94.2 C95.2 D17.2(A) R144.2 R145.2 R200.1 U23.9(GND) U23.11(GND)
1V8_out: C92.2 C93.2 L12.2 R140.1 R141.1 TP78.1 ; port 1V8_out
PG_Module: R203.1 ; port PG_Module
VIN: L11.2 ; port VIN
NetC88_1: C88.1 D17.1(K) L12.1 U23.10(PH)
NetC88_2: C88.2 U23.1(BOOT)
NetC89_1: C89.1 C90.2 L11.1 U23.2(VIN)
NetC91_2: C91.2 U23.4(SS/TR)
NetC94_1: C94.1 R143.2
NetC95_1: C95.1 R143.1 U23.8(COMP)
NetR140_2: R140.2 U23.6(PWRGD)
NetR141_2: R141.2 R144.1 U23.7(VSENSE)
NetR145_1: R145.1 U23.5(RT/CLK)
NetR200_2: R200.2 R203.2 TP79.1 U23.3(EN)

### Layout directives
net class PWR: 1V8_out, NetC89_1

### Notes on the sheet
- (near U23) 1.8V / 2.5A
- Title
- Revision:
- Design Engineer:
- Date:
- Project:
- Sheet
- of

### Library data of the parts
C88 C90 C91 = UZgen_C_0603_100nF_50V_X7R: Generic capacitor; Manufacturer: UZgen; Tolerance: 10 %; Created from: AGeiger; Value: 100 nF; Technology: X7R; Manufacturer Part Number: UZgen_C_0603_100nF_50V_X7R; PartID: 1; Created On: 02/07/2024 14:42:23; Device Package: 0603; Mounting Type: SMD; Last Updated: 02/08/2024 14:45:57
C89 = CL31B106KBHNNNE: 50V 10uF X7R ±10% 1206  Multilayer Ceramic Capacitors MLCC - SMD/SMT ROHS; Manufacturer: Samsung Electro-Mechanics; Voltage Rating: 50 VDC; Created from: AGeiger; Value: 10 µF; Tolerance: 10 %; Manufacturer Part Number: CL31B106KBHNNNE; PartID: 107; Created On: 20/09/2022 20:14:50; ComponentLink1Description: Datasheet; ComponentLink1URL: https://datasheet.lcsc.com/lcsc/1810221111_Samsung-Electro-Mechanics-CL31B106KBHNNNE_C89632.pdf; Component Type: Capacitor 1206; Device Package: 1206; Last Updated: 02/08/2024 15:35:49; Mounting Type: SMD; Operating Temperature: -55 - 125°C; Series: X7R; Supplier 1: LCSC; Supplier Part Number 1: C89632; Type: Capacitor; Live Cycle Status: 1; LCSC Part Number: C89632
C92 C93 = UZgen_C_0805_47uF_6.3V_X7R: Generic capacitor; Manufacturer: UZgen; Tolerance: 10 %; Created from: UZgenTool; Value: 47 µF; Technology: X7R; Manufacturer Part Number: UZgen_C_0805_47uF_6.3V_X7R; PartID: 5223; Created On: 02/08/2024 11:18:30; Device Package: 0805; Mounting Type: SMD; Last Updated: 02/08/2024 11:18:30
C94 = GRM1885C1H472JA01D: 50V 4.7nF C0G ±5% 0603 Multilayer Ceramic Capacitors MLCC; Manufacturer: Murata Electronics; Created from: MGeier; Tolerance: 5%; Value: 4.7 nF; Manufacturer Part Number: GRM1885C1H472JA01D; PartID: 153; Created On: 02/08/2024 16:00:00; ComponentLink1Description: Datasheet; ComponentLink1URL: https://wmsc.lcsc.com/wmsc/upload/file/pdf/v2/lcsc/2304140030_Murata-Electronics-GRM1885C1H472JA01D_C85980.pdf; Component Type: Capacitor 0603; Device Package: 0603; Last Updated: 02/08/2024 16:00:00; Mounting Type: SMD; Operating Temperature: –55 to 125°C; Series: GRM (Chip Multilayer Ceramic Capacitors for General Purpose); Supplier 1: LCSC; Supplier Part Number 1: C85980; Type: Capacitor; Voltage Rating: 50 V; Live Cycle Status: 1; LCSC Part Number: C85980; Stock number: not stored
C95 = CL10C470JB8NNNC: 50V 47pF C0G ±5% 0603 Multilayer Ceramic Capacitors MLCC; Manufacturer: Samsung Electro-Mechanics; Created from: MGeier; Tolerance: 5%; Value: 47 pF; Manufacturer Part Number: CL10C470JB8NNNC; PartID: 154; Created On: 02/08/2024 16:00:00; ComponentLink1Description: Datasheet; ComponentLink1URL: https://wmsc.lcsc.com/wmsc/upload/file/pdf/v2/lcsc/2304140030_Samsung-Electro-Mechanics-CL10C470JB8NNNC_C1671.pdf; Component Type: Capacitor 0603; Device Package: 0603; Last Updated: 02/08/2024 16:00:00; Mounting Type: SMD; Operating Temperature: –55 to 125°C; Series: CL; Supplier 1: LCSC; Supplier Part Number 1: C1671; Type: Capacitor; Voltage Rating: 50 V; Live Cycle Status: 1; LCSC Part Number: C1671; Stock number: not stored
D17 = STPS340UY: Power Schottky Rectifier, 3 A, 40 V, 0.57 µF; Manufacturer: STMicroelectronics; Forward Current: 3 A; Forward Voltage: 0.84 V; Reverse Current: 10 mA; Created from: MGremer; Manufacturer Part Number: STPS340UY; PartID: 1; Created On: 06.01.2021 14:34:10; ComponentLink1Description: Datasheet; ComponentLink1URL: https://www.mouser.de/datasheet/2/389/stps340_y-1851750.pdf; Component Type: Power Schottky Rectifier; Device Package: SMB; Last Updated: 15.02.2021 09:42:48; Mounting Type: SMD; Operating Temperature: -40 - 150 °C; Series: STPS340-Y; Supplier 1: Mouser; Supplier Part Number 1: 511-STPS340UY; Type: Power Schottky Rectifier; Value: -; Live Cycle Status: 1; Stock number: not stored
L11 = 24513: Ferritdurchführung SMD 0805; AN: 24513; Voltage: 2000mA; Mixed: SMT; Trenz-Stock: Yes; H-ART: 742792040; Extra: 0,15 Ohm DC, 600 Ohm bei 100MHz, 700 Ohm bei 150Mhz, 2000mA; Case: 2012 (0805); Technology: 0.15Ohm; HelpURL: B:\AD\adlib\datasheet\742792040
L12 = 26235: Power Inductor 15µH 20% 3.9A 76.7mOhms; AN: 26235; Mixed: SMT; Voltage: 3.9A 76.7mOhms; HelpURL: B:\AD\adlib\datasheet\xal50xx; H-ART: XAL5050-153MEC; Extra: XAL5050-153MEC
R140 R143 = UZgen_R_0603_20k: Generic resistor; Manufacturer: UZgen; Tolerance: 1 %; Created from: UZgenTool; Value: 20k; Manufacturer Part Number: UZgen_R_0603_20k; PartID: 251; Created On: 02.07.2024 17:29:50; Device Package: 0603; Mounting Type: SMD; Last Updated: 02.07.2024 17:29:50
R141 = UZgen_R_0603_2k: Generic resistor; Manufacturer: UZgen; Tolerance: 1 %; Created from: UZgenTool; Value: 2k; Manufacturer Part Number: UZgen_R_0603_2k; PartID: 228; Created On: 02.07.2024 17:29:49; Device Package: 0603; Mounting Type: SMD; Last Updated: 02.07.2024 17:29:49
R144 = UZgen_R_0603_1k6: Generic resistor; Manufacturer: UZgen; Tolerance: 1 %; Created from: UZgenTool; Value: 1k6; Manufacturer Part Number: UZgen_R_0603_1k6; PartID: 226; Created On: 02.07.2024 17:29:49; Device Package: 0603; Mounting Type: SMD; Last Updated: 02.07.2024 17:29:49
R145 = UZgen_R_0603_412k: Non generic resistor; Manufacturer: UZgen; Tolerance: 1 %; Created from: UZgenTool; Value: 412k TK100; Manufacturer Part Number: UZgen_R_0603_412k; PartID: 585; Created On: 08.07.2024 14:34:30; Device Package: 0603; Mounting Type: SMD; Last Updated: 10.07.2024 12:46:24
R200 R203 = UZgen_R_0603_10k: as R111-R119 on sheet Collective_FAULT_logic; Value: 10k; Manufacturer Part Number: UZgen_R_0603_10k; PartID: 1; Created On: 02.07.2024 14:34:53; Device Package: 0603; Mounting Type: SMD; Last Updated: 02.07.2024 14:37:16
TP78 TP79 = 25063: AN: 25063; Mixed: SMT
U23 = TPS54260QDGQRQ1: Switching Voltage Regulators 3.5-42Vin,2.5A,2.5 MHz Step-Down Cnvrtr; Manufacturer: Texas Instruments; Created from: FRosner; Manufacturer Part Number: TPS54260QDGQRQ1; PartID: 5; Created On: 19.06.2024 15:45:41; ComponentLink1Description: Datasheet; ComponentLink1URL: https://www.ti.com/lit/ds/symlink/tps54260-q1.pdf?ts=1718807277251&ref_url=https%253A%252F%252Fwww.mouser.de%252F; Component Type: DC-DC Converters ROHS; Last Updated: 19.06.2024 15:45:41; Mounting Type: SMD; Operating Temperature: -40 - 125 °C; Supplier 1: Mouser; Supplier Part Number 1: 595-TPS54260QDGQRQ1; Supplier 2: LCSC; Supplier Part Number 2: C181278; Type: Switching Regulator; Live Cycle Status: 1; LCSC Part Number: C181278; Stock number: not stored

## Sheet FrontPanel.SchDoc
size A4; Author: A. Geiger & E. Liegmann; CompanyName: Technische Hochschule Nürnberg Georg Simon Ohm; Organization: UltraZohm; Address1: Kesslerplatz 12; Address2: 90489 Nürnberg; Address3: GERMANY; SheetNumber: 24; SheetTotal: 36; Website: www.ultrazohm.com
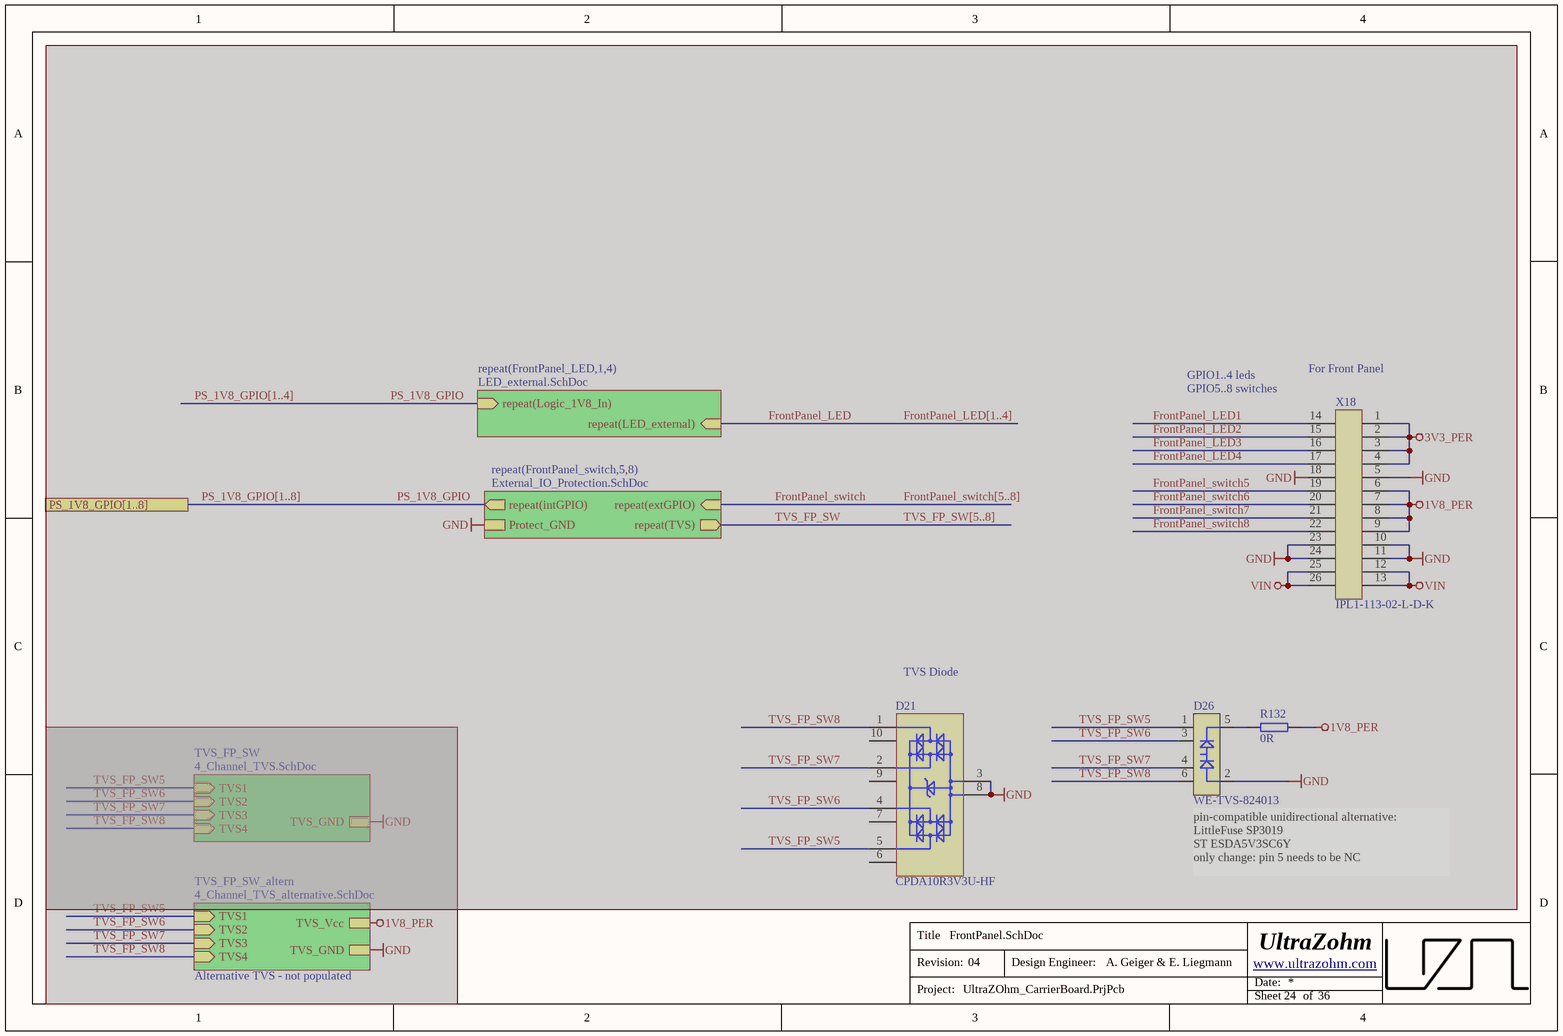
[diagram p30: FrontPanel.SchDoc]

### Parts
D21  CPDA10R3V3U-HF  [DFN230X100X55X10N]  (masked out: inside a compile mask, not in the netlist)
D26  WE-TVS-824013  [SOT95P280X145-6N]  (masked out: inside a compile mask, not in the netlist)
R132  0R  [R_0603_TE]  (masked out: inside a compile mask, not in the netlist)
X18  IPL1-113-02-L-D-K  [IPL1-113-02-L-D-K]  (masked out: inside a compile mask, not in the netlist)

### Sub-sheets
repeat(FrontPanel_LED,1,4) = LED_external.SchDoc (masked out): repeat(LED_external) (in), repeat(Logic_1V8_In) (in)
repeat(FrontPanel_switch,5,8) = External_IO_Protection.SchDoc (masked out): repeat(extGPIO) (in), repeat(intGPIO) (out), repeat(TVS) (out), Protect_GND
TVS_FP_SW = 4_Channel_TVS.SchDoc (masked out) (file not in this document): TVS_GND, TVS1 (in), TVS2 (in), TVS3 (in), TVS4 (in)
TVS_FP_SW_altern = 4_Channel_TVS_alternative.SchDoc (masked out) (file not in this document): TVS_GND, TVS1 (in), TVS2 (in), TVS3 (in), TVS4 (in), TVS_Vcc

### Ports
PS_1V8_GPIO[1..8]

### Notes on the sheet
- GPIO1..4 leds
- (near X18) For Front Panel
- (near X18) GPIO5..8 switches
- (near D21) TVS Diode
- (near D26) pin-compatible unidirectional alternative:
  LittleFuse SP3019
  ST ESDA5V3SC6Y
  only change: pin 5 needs to be NC
- Alternative TVS - not populated
- Title
- Revision:
- Design Engineer:
- Date:
- Project:
- Sheet
- of

### Library data of the parts
D21 = 29054: AN: 29054; Voltage: 3.3V; Mixed: SMT; Temperature-Range: -55/+125; Extra: Diode Array TVS Diode ESD Protection 4-channel; Case: TSLP-9-1; HelpURL: b:\AD\adlib\datasheet\CPDA10R3V3U-HF\; H-ART: CPDA10R3V3U-HF
D26 = 23986: TVS/Clamp Diode Array 3.3/9V Quad SOT23-6; AN: 23986; Mixed: SMT; Trenz-Stock: Yes; H-ART: 824013; Extra: ESD Protection for 4 lines, Low capacitance; Case: SOT23-6; HelpURL: B:\AD\adlib\datasheet\WE-TVS-824013; Preferred: Yes
R132 = UZgen_R_0603_0R: as R34 on sheet Pilot_Line; Value: 0R; Manufacturer Part Number: UZgen_R_0603_0R; PartID: 581; Created On: 08.07.2024 14:34:30; Device Package: 0603; Mounting Type: SMD; Last Updated: 08.07.2024 14:34:30
X18 = 30828: AN: 30828; Mixed: SMT; Temperature-Range: -55/+125; Extra: Connector Header IPL1, 2-row 26pos, key polarization, SMT 0°; Case: IPL1; HelpURL: b:\AD\adlib\datasheet\Samtec\IPL1-SMT\; H-ART: IPL1-113-02-L-D-K

## Nets that join several sheets
1V8_PER: Signal_Distribution (R34ANL.2 R74.2 R75.2), U_Signal_Distribution/DIG1 (16 pins), U_Signal_Distribution/DIG2 (16 pins), U_Signal_Distribution/DIG3 (16 pins), U_Signal_Distribution/DIG4 (16 pins), U_Signal_Distribution/DIG5 (16 pins), ETH-PHY (11 pins), SD_Card (C71.1 U13.5), Power_Supply_2 (R139.2 R139Y.2 R148.1), ETH-PHY_SGMII (11 pins)
3V3_MOD: Signal_Distribution (R71.2), Power_Supply_1 (10 pins), J1 (5 pins), J2 (25 pins), J3 (5 pins)
3V3_PER: Signal_Distribution (5 pins), U_Signal_Distribution/DIG1 (18 pins), U_Signal_Distribution/DIG2 (18 pins), U_Signal_Distribution/DIG3 (18 pins), U_Signal_Distribution/DIG4 (18 pins), U_Signal_Distribution/DIG5 (18 pins), ETH-PHY (5 pins), SD_Card (C72.2 U13.17 U13.21 X16.4), Power_Supply_1 (9 pins), Power_Supply_2 (D16.2 D18.2), ETH-PHY_SGMII (13 pins), Pilot_Line (8 pins), CPLD_Programming (L2.2 X1.5 X1.6)
5V_PER: Signal_Distribution (R73.2), Power_Supply_1 (8 pins)
GND: Signal_Distribution (9 pins), U_Signal_Distribution/DIG1 (76 pins), U_Signal_Distribution/DIG2 (76 pins), U_Signal_Distribution/DIG3 (76 pins), U_Signal_Distribution/DIG4 (76 pins), U_Signal_Distribution/DIG5 (76 pins), U_Signal_Distribution/ANL1 (30 pins), U_Signal_Distribution/ANL2 (30 pins), U_Signal_Distribution/ANL3 (30 pins), ETH-PHY (21 pins), SD_Card (10 pins), Power_Supply_1 (53 pins), Power_Supply_2 (6 pins), Power_Supply_Input (9 pins), J1 (50 pins), J2 (60 pins), J3 (30 pins), J4 (44 pins), ETH-PHY_SGMII (37 pins), GTR (5 pins), Pilot_Line (R42.1), CPLD_Programming (19 pins), Power_Supply_1V8 (13 pins)
PS_1V8: J2 (9 pins), J3 (J3.147 J3.148)
VCCO_47: Power_Supply_2 (R128.2), J3 (J3.43 J3.44)
VCCO_48: Power_Supply_2 (R129.2), J3 (J3.15 J3.16)
VCCO_64: Power_Supply_2 (R133.2), J4 (J4.58 J4.106)
VCCO_65: Power_Supply_2 (R131.2), J4 (J4.69 J4.105)
VCCO_66: Power_Supply_2 (R136.2), J1 (J1.90 J1.120)
VIN: Signal_Distribution (R70.2), Power_Supply_1 (L6.2 L7.2 L8.2), Power_Supply_Input (12 pins), DiagLEDs (7 pins)
ADDR0: Signal_Distribution (NT1.1), U_Signal_Distribution/ANL1 (X5A.61)
ADDR0: Signal_Distribution (NT4.1), U_Signal_Distribution/ANL3 (X5C.61)
ADDR0_D2: Signal_Distribution (NT6.1), U_Signal_Distribution/DIG2 (X6B.79)
ADDR0_D4: Signal_Distribution (NT9.1), U_Signal_Distribution/DIG4 (X6D.79)
ADDR1: Signal_Distribution (NT2.1), U_Signal_Distribution/ANL1 (X5A.77)
ADDR1: Signal_Distribution (NT3.1), U_Signal_Distribution/ANL2 (X5B.77)
ADDR1_D2: Signal_Distribution (NT7.1), U_Signal_Distribution/DIG2 (X6B.95)
ADDR1_D3: Signal_Distribution (NT8.1), U_Signal_Distribution/DIG3 (X6C.95)
ADDR2_D1: Signal_Distribution (NT5.1), U_Signal_Distribution/DIG1 (X6A.80)
ASlots_SCL_3V3: Signal_Distribution (R97.1), U_Signal_Distribution/ANL1 (X5A.49), U_Signal_Distribution/ANL2 (X5B.49), U_Signal_Distribution/ANL3 (X5C.49)
ASlots_SDA_3V3: Signal_Distribution (R99.1), U_Signal_Distribution/ANL1 (X5A.50), U_Signal_Distribution/ANL2 (X5B.50), U_Signal_Distribution/ANL3 (X5C.50)
CPLD_TCK: U_Signal_Distribution/DIG1 (U4A.91), U_Signal_Distribution/DIG2 (U4B.91), U_Signal_Distribution/DIG3 (U4C.91), U_Signal_Distribution/DIG4 (U4D.91), U_Signal_Distribution/DIG5 (U4E.91)
CPLD_TDI2: U_Signal_Distribution/DIG1 (U4A.95), U_Signal_Distribution/DIG2 (U4B.94)
CPLD_TDI3: U_Signal_Distribution/DIG2 (U4B.95), U_Signal_Distribution/DIG3 (U4C.94)
CPLD_TDI4: U_Signal_Distribution/DIG3 (U4C.95), U_Signal_Distribution/DIG4 (U4D.94)
CPLD_TDI5: U_Signal_Distribution/DIG4 (U4D.95), U_Signal_Distribution/DIG5 (U4E.94)
CPLD_TMS: U_Signal_Distribution/DIG1 (U4A.90), U_Signal_Distribution/DIG2 (U4B.90), U_Signal_Distribution/DIG3 (U4C.90), U_Signal_Distribution/DIG4 (U4D.90), U_Signal_Distribution/DIG5 (U4E.90)
CPLDs_SCL_1V8: Signal_Distribution (R74.1), U_Signal_Distribution/DIG1 (U4A.86), U_Signal_Distribution/DIG2 (U4B.86), U_Signal_Distribution/DIG3 (U4C.86), U_Signal_Distribution/DIG4 (U4D.86), U_Signal_Distribution/DIG5 (U4E.86)
CPLDs_SDA_1V8: Signal_Distribution (R75.1), U_Signal_Distribution/DIG1 (U4A.85), U_Signal_Distribution/DIG2 (U4B.85), U_Signal_Distribution/DIG3 (U4C.85), U_Signal_Distribution/DIG4 (U4D.85), U_Signal_Distribution/DIG5 (U4E.85)
DSlots_SCL_3V3: Signal_Distribution (R84.1), U_Signal_Distribution/DIG1 (X6A.89), U_Signal_Distribution/DIG2 (X6B.89), U_Signal_Distribution/DIG3 (X6C.89), U_Signal_Distribution/DIG4 (X6D.89), U_Signal_Distribution/DIG5 (X6E.89)
DSlots_SDA_3V3: Signal_Distribution (R85.1), U_Signal_Distribution/DIG1 (X6A.90), U_Signal_Distribution/DIG2 (X6B.90), U_Signal_Distribution/DIG3 (X6C.90), U_Signal_Distribution/DIG4 (X6D.90), U_Signal_Distribution/DIG5 (X6E.90)
GTH_CLK_N: U_Signal_Distribution/ANL1 (X5A.74), GTH (C101.2)
GTH_CLK_N: U_Signal_Distribution/ANL2 (X5B.74), GTH (C150#1.2)
GTH_CLK_N: U_Signal_Distribution/ANL3 (X5C.74), GTH (C152#1.2)
GTH_CLK_P: U_Signal_Distribution/ANL1 (X5A.72), GTH (C100.2)
GTH_CLK_P: U_Signal_Distribution/ANL2 (X5B.72), GTH (C149#1.2)
GTH_CLK_P: U_Signal_Distribution/ANL3 (X5C.72), GTH (C151#1.2)
GTH_RX_N: U_Signal_Distribution/ANL1 (X5A.71), GTH (C156.2)
GTH_RX_N: U_Signal_Distribution/ANL2 (X5B.71), GTH (C160#1.2)
GTH_RX_N: U_Signal_Distribution/ANL3 (X5C.71), GTH (C164.2)
GTH_RX_P: U_Signal_Distribution/ANL1 (X5A.73), GTH (C155.2)
GTH_RX_P: U_Signal_Distribution/ANL2 (X5B.73), GTH (C159#1.2)
GTH_RX_P: U_Signal_Distribution/ANL3 (X5C.73), GTH (C163.2)
GTH_TX_N: U_Signal_Distribution/ANL1 (X5A.67), GTH (C154.2)
GTH_TX_N: U_Signal_Distribution/ANL2 (X5B.67), GTH (C158#1.2)
GTH_TX_N: U_Signal_Distribution/ANL3 (X5C.67), GTH (C162.2)
GTH_TX_P: U_Signal_Distribution/ANL1 (X5A.65), GTH (C153.2)
GTH_TX_P: U_Signal_Distribution/ANL2 (X5B.65), GTH (C157#1.2)
GTH_TX_P: U_Signal_Distribution/ANL3 (X5C.65), GTH (C161#1.2)
NetU4A_76: U_Signal_Distribution/DIG1 (U4A.76), U_Signal_Distribution/DIG2 (U4B.76), U_Signal_Distribution/DIG3 (U4C.76), U_Signal_Distribution/DIG4 (U4D.76), U_Signal_Distribution/DIG5 (U4E.76)
NetU4A_77: U_Signal_Distribution/DIG1 (U4A.77), U_Signal_Distribution/DIG2 (U4B.77), U_Signal_Distribution/DIG3 (U4C.77), U_Signal_Distribution/DIG4 (U4D.77), U_Signal_Distribution/DIG5 (U4E.77)
PILOT_OUT: U_Signal_Distribution/ANL1 (X5A.79), U_Signal_Distribution/ANL2 (X5B.79), U_Signal_Distribution/ANL3 (X5C.79)
SPI_CLK_1V8: U_Signal_Distribution/DIG1 (U4A.31), U_Signal_Distribution/DIG2 (U4B.31), U_Signal_Distribution/DIG3 (U4C.31), U_Signal_Distribution/DIG4 (U4D.31), U_Signal_Distribution/DIG5 (U4E.31)
SPI_MISO_1V8: U_Signal_Distribution/DIG1 (U4A.32), U_Signal_Distribution/DIG2 (U4B.32), U_Signal_Distribution/DIG3 (U4C.32), U_Signal_Distribution/DIG4 (U4D.32), U_Signal_Distribution/DIG5 (U4E.32)
SPI_MOSI_1V8: U_Signal_Distribution/DIG1 (U4A.49), U_Signal_Distribution/DIG2 (U4B.49), U_Signal_Distribution/DIG3 (U4C.49), U_Signal_Distribution/DIG4 (U4D.49), U_Signal_Distribution/DIG5 (U4E.49)